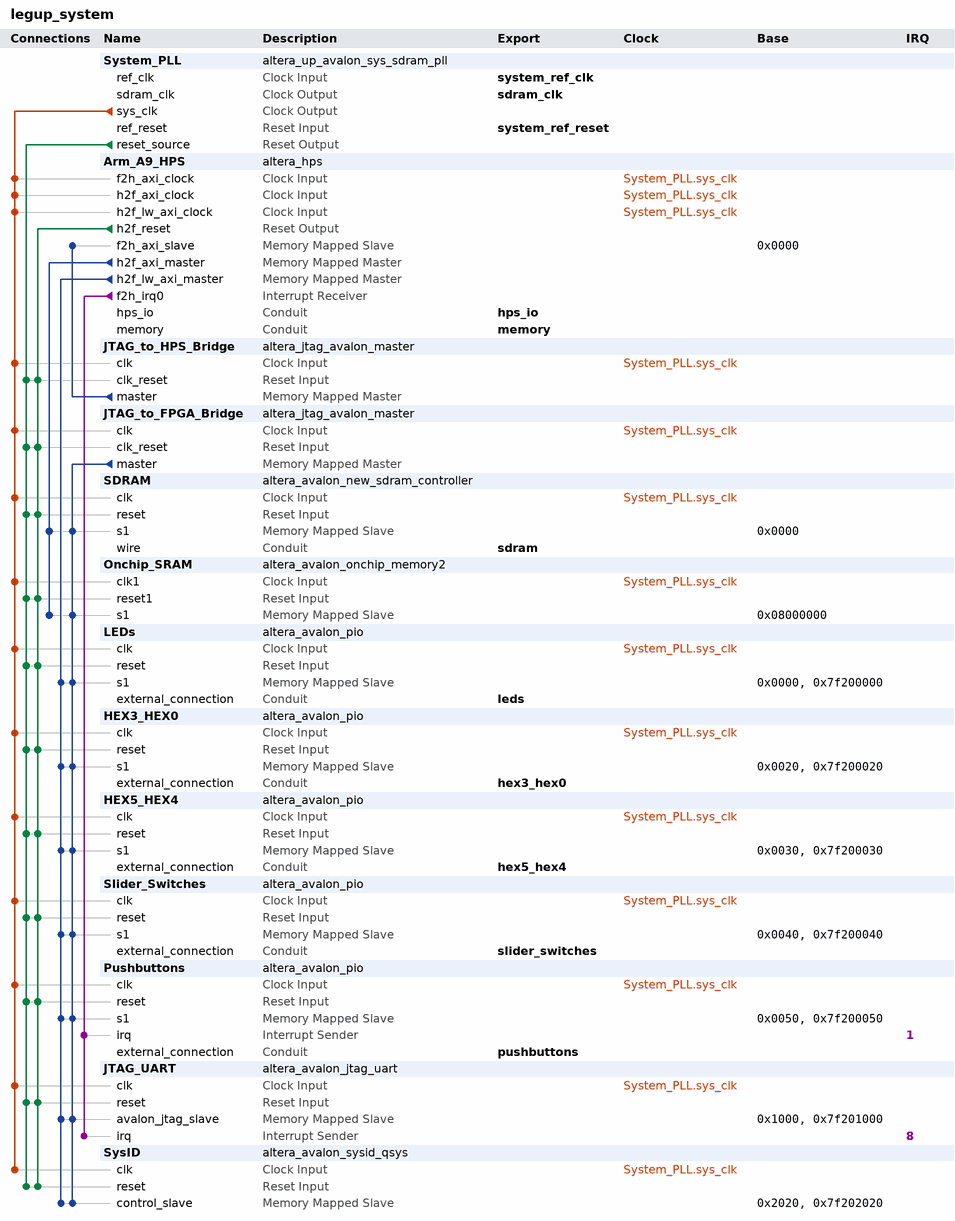
[diagram p0: system contents]
# Platform Designer (Qsys) system legup_system, Cyclone V 5CSEMA5F31C6
# Parameters at their usual value, and those the tool derives, are not listed.
package require -exact qsys 13.1
create_system legup_system
set_project_property DEVICE_FAMILY {Cyclone V}
set_project_property DEVICE 5CSEMA5F31C6

add_instance System_PLL altera_up_avalon_sys_sdram_pll 13.1
set_instance_parameter_value System_PLL gui_refclk 50.0
set_instance_parameter_value System_PLL gui_outclk 50.0
set_instance_parameter_value System_PLL CV_boards DE1-SoC

add_instance Arm_A9_HPS altera_hps 13.1
set_instance_parameter_value Arm_A9_HPS MEM_VENDOR JEDEC
set_instance_parameter_value Arm_A9_HPS MEM_ROW_ADDR_WIDTH 15
set_instance_parameter_value Arm_A9_HPS MEM_COL_ADDR_WIDTH 10
set_instance_parameter_value Arm_A9_HPS MEM_DQ_WIDTH 32
set_instance_parameter_value Arm_A9_HPS MEM_BANKADDR_WIDTH 3
set_instance_parameter_value Arm_A9_HPS MEM_DRV_STR RZQ/7
set_instance_parameter_value Arm_A9_HPS MEM_RTT_NOM RZQ/4
set_instance_parameter_value Arm_A9_HPS MEM_RTT_WR RZQ/4
set_instance_parameter_value Arm_A9_HPS MEM_WTCL 8
set_instance_parameter_value Arm_A9_HPS MEM_TCL 11
set_instance_parameter_value Arm_A9_HPS TIMING_TIS 180
set_instance_parameter_value Arm_A9_HPS TIMING_TIH 140
set_instance_parameter_value Arm_A9_HPS TIMING_TDS 30
set_instance_parameter_value Arm_A9_HPS TIMING_TDH 65
set_instance_parameter_value Arm_A9_HPS TIMING_TDQSQ 125
set_instance_parameter_value Arm_A9_HPS TIMING_TDQSCK 255
set_instance_parameter_value Arm_A9_HPS TIMING_TQSH 0.4
set_instance_parameter_value Arm_A9_HPS MEM_TRAS_NS 35.0
set_instance_parameter_value Arm_A9_HPS MEM_TRCD_NS 13.75
set_instance_parameter_value Arm_A9_HPS MEM_TRP_NS 13.75
set_instance_parameter_value Arm_A9_HPS MEM_TRFC_NS 260.0
set_instance_parameter_value Arm_A9_HPS MEM_TFAW_NS 30.0
set_instance_parameter_value Arm_A9_HPS REF_CLK_FREQ 25.0
set_instance_parameter_value Arm_A9_HPS DEFAULT_FAST_SIM_MODEL true
set_instance_parameter_value Arm_A9_HPS TIMING_BOARD_MAX_CK_DELAY 0.03
set_instance_parameter_value Arm_A9_HPS TIMING_BOARD_MAX_DQS_DELAY 0.02
set_instance_parameter_value Arm_A9_HPS TIMING_BOARD_SKEW_CKDQS_DIMM_MIN 0.09
set_instance_parameter_value Arm_A9_HPS TIMING_BOARD_SKEW_CKDQS_DIMM_MAX 0.16
set_instance_parameter_value Arm_A9_HPS TIMING_BOARD_SKEW_WITHIN_DQS 0.01
set_instance_parameter_value Arm_A9_HPS TIMING_BOARD_SKEW_BETWEEN_DQS 0.08
set_instance_parameter_value Arm_A9_HPS TIMING_BOARD_DQ_TO_DQS_SKEW 0.0
set_instance_parameter_value Arm_A9_HPS TIMING_BOARD_AC_SKEW 0.03
set_instance_parameter_value Arm_A9_HPS TIMING_BOARD_AC_TO_CK_SKEW 0.0
set_instance_parameter_value Arm_A9_HPS MEM_CLK_FREQ 400.0
set_instance_parameter_value Arm_A9_HPS HPS_PROTOCOL DDR3
set_instance_parameter_value Arm_A9_HPS STM_Enable false
set_instance_parameter_value Arm_A9_HPS F2S_Width 2
set_instance_parameter_value Arm_A9_HPS S2F_Width 3
set_instance_parameter_value Arm_A9_HPS LWH2F_Enable true
set_instance_parameter_value Arm_A9_HPS F2SCLK_DBGRST_Enable false
set_instance_parameter_value Arm_A9_HPS F2SCLK_WARMRST_Enable false
set_instance_parameter_value Arm_A9_HPS F2SCLK_COLDRST_Enable false
set_instance_parameter_value Arm_A9_HPS F2SINTERRUPT_Enable true
set_instance_parameter_value Arm_A9_HPS EMAC1_PinMuxing {HPS I/O Set 0}
set_instance_parameter_value Arm_A9_HPS EMAC1_Mode RGMII
set_instance_parameter_value Arm_A9_HPS QSPI_PinMuxing {HPS I/O Set 0}
set_instance_parameter_value Arm_A9_HPS QSPI_Mode {1 SS}
set_instance_parameter_value Arm_A9_HPS SDIO_PinMuxing {HPS I/O Set 0}
set_instance_parameter_value Arm_A9_HPS SDIO_Mode {4-bit Data}
set_instance_parameter_value Arm_A9_HPS USB1_PinMuxing {HPS I/O Set 0}
set_instance_parameter_value Arm_A9_HPS USB1_Mode SDR
set_instance_parameter_value Arm_A9_HPS SPIM1_PinMuxing {HPS I/O Set 0}
set_instance_parameter_value Arm_A9_HPS SPIM1_Mode {Single Slave Select}
set_instance_parameter_value Arm_A9_HPS UART0_PinMuxing {HPS I/O Set 0}
set_instance_parameter_value Arm_A9_HPS UART0_Mode {No Flow Control}
set_instance_parameter_value Arm_A9_HPS I2C0_PinMuxing {HPS I/O Set 0}
set_instance_parameter_value Arm_A9_HPS I2C0_Mode I2C
set_instance_parameter_value Arm_A9_HPS I2C1_PinMuxing {HPS I/O Set 0}
set_instance_parameter_value Arm_A9_HPS I2C1_Mode I2C
set_instance_parameter_value Arm_A9_HPS S2FCLK_USER1CLK_FREQ 100
set_instance_parameter_value Arm_A9_HPS FPGA_PERIPHERAL_OUTPUT_CLOCK_FREQ_EMAC0_MD_CLK 100
set_instance_parameter_value Arm_A9_HPS FPGA_PERIPHERAL_OUTPUT_CLOCK_FREQ_EMAC0_GTX_CLK 100
set_instance_parameter_value Arm_A9_HPS FPGA_PERIPHERAL_OUTPUT_CLOCK_FREQ_EMAC1_MD_CLK 100
set_instance_parameter_value Arm_A9_HPS FPGA_PERIPHERAL_OUTPUT_CLOCK_FREQ_EMAC1_GTX_CLK 100

add_instance JTAG_to_HPS_Bridge altera_jtag_avalon_master 13.1

add_instance JTAG_to_FPGA_Bridge altera_jtag_avalon_master 13.1

add_instance SDRAM altera_avalon_new_sdram_controller 13.1
set_instance_parameter_value SDRAM TAC 5.5
set_instance_parameter_value SDRAM TRCD 20.0
set_instance_parameter_value SDRAM TRP 20.0
set_instance_parameter_value SDRAM casLatency 3
set_instance_parameter_value SDRAM columnWidth 10
set_instance_parameter_value SDRAM dataWidth 16
set_instance_parameter_value SDRAM generateSimulationModel true
set_instance_parameter_value SDRAM model single_Micron_MT48LC4M32B2_7_chip
set_instance_parameter_value SDRAM numberOfBanks 4
set_instance_parameter_value SDRAM numberOfChipSelects 1
set_instance_parameter_value SDRAM powerUpDelay 100.0
set_instance_parameter_value SDRAM refreshPeriod 15.625
set_instance_parameter_value SDRAM rowWidth 13

add_instance Onchip_SRAM altera_avalon_onchip_memory2 13.1
set_instance_parameter_value Onchip_SRAM dataWidth 32
set_instance_parameter_value Onchip_SRAM dualPort false
set_instance_parameter_value Onchip_SRAM initMemContent true
set_instance_parameter_value Onchip_SRAM initializationFileName onchip_mem.hex
set_instance_parameter_value Onchip_SRAM memorySize 16384
set_instance_parameter_value Onchip_SRAM singleClockOperation true

add_instance LEDs altera_avalon_pio 13.1
set_instance_parameter_value LEDs direction Output
set_instance_parameter_value LEDs width 10

add_instance HEX3_HEX0 altera_avalon_pio 13.1
set_instance_parameter_value HEX3_HEX0 direction Output
set_instance_parameter_value HEX3_HEX0 width 32

add_instance HEX5_HEX4 altera_avalon_pio 13.1
set_instance_parameter_value HEX5_HEX4 direction Output
set_instance_parameter_value HEX5_HEX4 width 16

add_instance Slider_Switches altera_avalon_pio 13.1
set_instance_parameter_value Slider_Switches direction Input
set_instance_parameter_value Slider_Switches simDoTestBenchWiring true
set_instance_parameter_value Slider_Switches width 10

add_instance Pushbuttons altera_avalon_pio 13.1
set_instance_parameter_value Pushbuttons bitClearingEdgeCapReg true
set_instance_parameter_value Pushbuttons captureEdge true
set_instance_parameter_value Pushbuttons direction Input
set_instance_parameter_value Pushbuttons edgeType FALLING
set_instance_parameter_value Pushbuttons generateIRQ true
set_instance_parameter_value Pushbuttons irqType EDGE
set_instance_parameter_value Pushbuttons simDoTestBenchWiring true
set_instance_parameter_value Pushbuttons width 4

add_instance JTAG_UART altera_avalon_jtag_uart 13.1
set_instance_parameter_value JTAG_UART simInteractiveOptions NO_INTERACTIVE_WINDOWS

add_instance SysID altera_avalon_sysid_qsys 13.1
set_instance_parameter_value SysID id 232849605

# connections
add_connection System_PLL.sys_clk Arm_A9_HPS.f2h_axi_clock clock
add_connection System_PLL.sys_clk Arm_A9_HPS.h2f_axi_clock clock
add_connection System_PLL.sys_clk Arm_A9_HPS.h2f_lw_axi_clock clock
add_connection System_PLL.sys_clk HEX3_HEX0.clk clock
add_connection System_PLL.sys_clk HEX5_HEX4.clk clock
add_connection System_PLL.sys_clk JTAG_to_FPGA_Bridge.clk clock
add_connection System_PLL.sys_clk JTAG_to_HPS_Bridge.clk clock
add_connection System_PLL.sys_clk JTAG_UART.clk clock
add_connection System_PLL.sys_clk LEDs.clk clock
add_connection System_PLL.sys_clk Onchip_SRAM.clk1 clock
add_connection System_PLL.sys_clk Pushbuttons.clk clock
add_connection System_PLL.sys_clk SDRAM.clk clock
add_connection System_PLL.sys_clk Slider_Switches.clk clock
add_connection System_PLL.sys_clk SysID.clk clock
add_connection Arm_A9_HPS.h2f_reset HEX3_HEX0.reset reset
add_connection Arm_A9_HPS.h2f_reset HEX5_HEX4.reset reset
add_connection Arm_A9_HPS.h2f_reset JTAG_to_FPGA_Bridge.clk_reset reset
add_connection Arm_A9_HPS.h2f_reset JTAG_to_HPS_Bridge.clk_reset reset
add_connection Arm_A9_HPS.h2f_reset JTAG_UART.reset reset
add_connection Arm_A9_HPS.h2f_reset LEDs.reset reset
add_connection Arm_A9_HPS.h2f_reset Onchip_SRAM.reset1 reset
add_connection Arm_A9_HPS.h2f_reset Pushbuttons.reset reset
add_connection Arm_A9_HPS.h2f_reset SDRAM.reset reset
add_connection Arm_A9_HPS.h2f_reset Slider_Switches.reset reset
add_connection Arm_A9_HPS.h2f_reset SysID.reset reset
add_connection System_PLL.reset_source HEX3_HEX0.reset reset
add_connection System_PLL.reset_source HEX5_HEX4.reset reset
add_connection System_PLL.reset_source JTAG_to_FPGA_Bridge.clk_reset reset
add_connection System_PLL.reset_source JTAG_to_HPS_Bridge.clk_reset reset
add_connection System_PLL.reset_source JTAG_UART.reset reset
add_connection System_PLL.reset_source LEDs.reset reset
add_connection System_PLL.reset_source Onchip_SRAM.reset1 reset
add_connection System_PLL.reset_source Pushbuttons.reset reset
add_connection System_PLL.reset_source SDRAM.reset reset
add_connection System_PLL.reset_source Slider_Switches.reset reset
add_connection System_PLL.reset_source SysID.reset reset
add_connection Arm_A9_HPS.h2f_axi_master Onchip_SRAM.s1 avalon
set_connection_parameter_value Arm_A9_HPS.h2f_axi_master/Onchip_SRAM.s1 baseAddress 0x08000000
add_connection Arm_A9_HPS.h2f_axi_master SDRAM.s1 avalon
set_connection_parameter_value Arm_A9_HPS.h2f_axi_master/SDRAM.s1 baseAddress 0x0000
add_connection Arm_A9_HPS.h2f_lw_axi_master HEX3_HEX0.s1 avalon
set_connection_parameter_value Arm_A9_HPS.h2f_lw_axi_master/HEX3_HEX0.s1 baseAddress 0x0020
add_connection Arm_A9_HPS.h2f_lw_axi_master HEX5_HEX4.s1 avalon
set_connection_parameter_value Arm_A9_HPS.h2f_lw_axi_master/HEX5_HEX4.s1 baseAddress 0x0030
add_connection Arm_A9_HPS.h2f_lw_axi_master JTAG_UART.avalon_jtag_slave avalon
set_connection_parameter_value Arm_A9_HPS.h2f_lw_axi_master/JTAG_UART.avalon_jtag_slave baseAddress 0x1000
add_connection Arm_A9_HPS.h2f_lw_axi_master LEDs.s1 avalon
set_connection_parameter_value Arm_A9_HPS.h2f_lw_axi_master/LEDs.s1 baseAddress 0x0000
add_connection Arm_A9_HPS.h2f_lw_axi_master Pushbuttons.s1 avalon
set_connection_parameter_value Arm_A9_HPS.h2f_lw_axi_master/Pushbuttons.s1 baseAddress 0x0050
add_connection Arm_A9_HPS.h2f_lw_axi_master Slider_Switches.s1 avalon
set_connection_parameter_value Arm_A9_HPS.h2f_lw_axi_master/Slider_Switches.s1 baseAddress 0x0040
add_connection Arm_A9_HPS.h2f_lw_axi_master SysID.control_slave avalon
set_connection_parameter_value Arm_A9_HPS.h2f_lw_axi_master/SysID.control_slave baseAddress 0x2020
add_connection JTAG_to_FPGA_Bridge.master HEX3_HEX0.s1 avalon
set_connection_parameter_value JTAG_to_FPGA_Bridge.master/HEX3_HEX0.s1 baseAddress 0x7f200020
add_connection JTAG_to_FPGA_Bridge.master HEX5_HEX4.s1 avalon
set_connection_parameter_value JTAG_to_FPGA_Bridge.master/HEX5_HEX4.s1 baseAddress 0x7f200030
add_connection JTAG_to_FPGA_Bridge.master JTAG_UART.avalon_jtag_slave avalon
set_connection_parameter_value JTAG_to_FPGA_Bridge.master/JTAG_UART.avalon_jtag_slave baseAddress 0x7f201000
add_connection JTAG_to_FPGA_Bridge.master LEDs.s1 avalon
set_connection_parameter_value JTAG_to_FPGA_Bridge.master/LEDs.s1 baseAddress 0x7f200000
add_connection JTAG_to_FPGA_Bridge.master Onchip_SRAM.s1 avalon
set_connection_parameter_value JTAG_to_FPGA_Bridge.master/Onchip_SRAM.s1 baseAddress 0x08000000
add_connection JTAG_to_FPGA_Bridge.master Pushbuttons.s1 avalon
set_connection_parameter_value JTAG_to_FPGA_Bridge.master/Pushbuttons.s1 baseAddress 0x7f200050
add_connection JTAG_to_FPGA_Bridge.master SDRAM.s1 avalon
set_connection_parameter_value JTAG_to_FPGA_Bridge.master/SDRAM.s1 baseAddress 0x0000
add_connection JTAG_to_FPGA_Bridge.master Slider_Switches.s1 avalon
set_connection_parameter_value JTAG_to_FPGA_Bridge.master/Slider_Switches.s1 baseAddress 0x7f200040
add_connection JTAG_to_FPGA_Bridge.master SysID.control_slave avalon
set_connection_parameter_value JTAG_to_FPGA_Bridge.master/SysID.control_slave baseAddress 0x7f202020
add_connection JTAG_to_HPS_Bridge.master Arm_A9_HPS.f2h_axi_slave avalon
set_connection_parameter_value JTAG_to_HPS_Bridge.master/Arm_A9_HPS.f2h_axi_slave baseAddress 0x0000
add_connection Arm_A9_HPS.f2h_irq0 JTAG_UART.irq interrupt
set_connection_parameter_value Arm_A9_HPS.f2h_irq0/JTAG_UART.irq irqNumber 8
add_connection Arm_A9_HPS.f2h_irq0 Pushbuttons.irq interrupt
set_connection_parameter_value Arm_A9_HPS.f2h_irq0/Pushbuttons.irq irqNumber 1

# exported interfaces
add_interface system_ref_clk clock sink
set_interface_property system_ref_clk EXPORT_OF System_PLL.ref_clk
add_interface system_ref_reset reset sink
set_interface_property system_ref_reset EXPORT_OF System_PLL.ref_reset
add_interface sdram_clk clock source
set_interface_property sdram_clk EXPORT_OF System_PLL.sdram_clk
add_interface memory conduit end
set_interface_property memory EXPORT_OF Arm_A9_HPS.memory
add_interface hps_io conduit end
set_interface_property hps_io EXPORT_OF Arm_A9_HPS.hps_io
add_interface sdram conduit end
set_interface_property sdram EXPORT_OF SDRAM.wire
add_interface leds conduit end
set_interface_property leds EXPORT_OF LEDs.external_connection
add_interface hex3_hex0 conduit end
set_interface_property hex3_hex0 EXPORT_OF HEX3_HEX0.external_connection
add_interface hex5_hex4 conduit end
set_interface_property hex5_hex4 EXPORT_OF HEX5_HEX4.external_connection
add_interface slider_switches conduit end
set_interface_property slider_switches EXPORT_OF Slider_Switches.external_connection
add_interface pushbuttons conduit end
set_interface_property pushbuttons EXPORT_OF Pushbuttons.external_connection

set_interconnect_requirement {$system} qsys_mm.clockCrossingAdapter HANDSHAKE
set_interconnect_requirement {$system} qsys_mm.maxAdditionalLatency 1
set_interconnect_requirement {$system} qsys_mm.insertDefaultSlave false

save_system legup_system.qsys
